# Altium project AD9434-500.PrjPcb
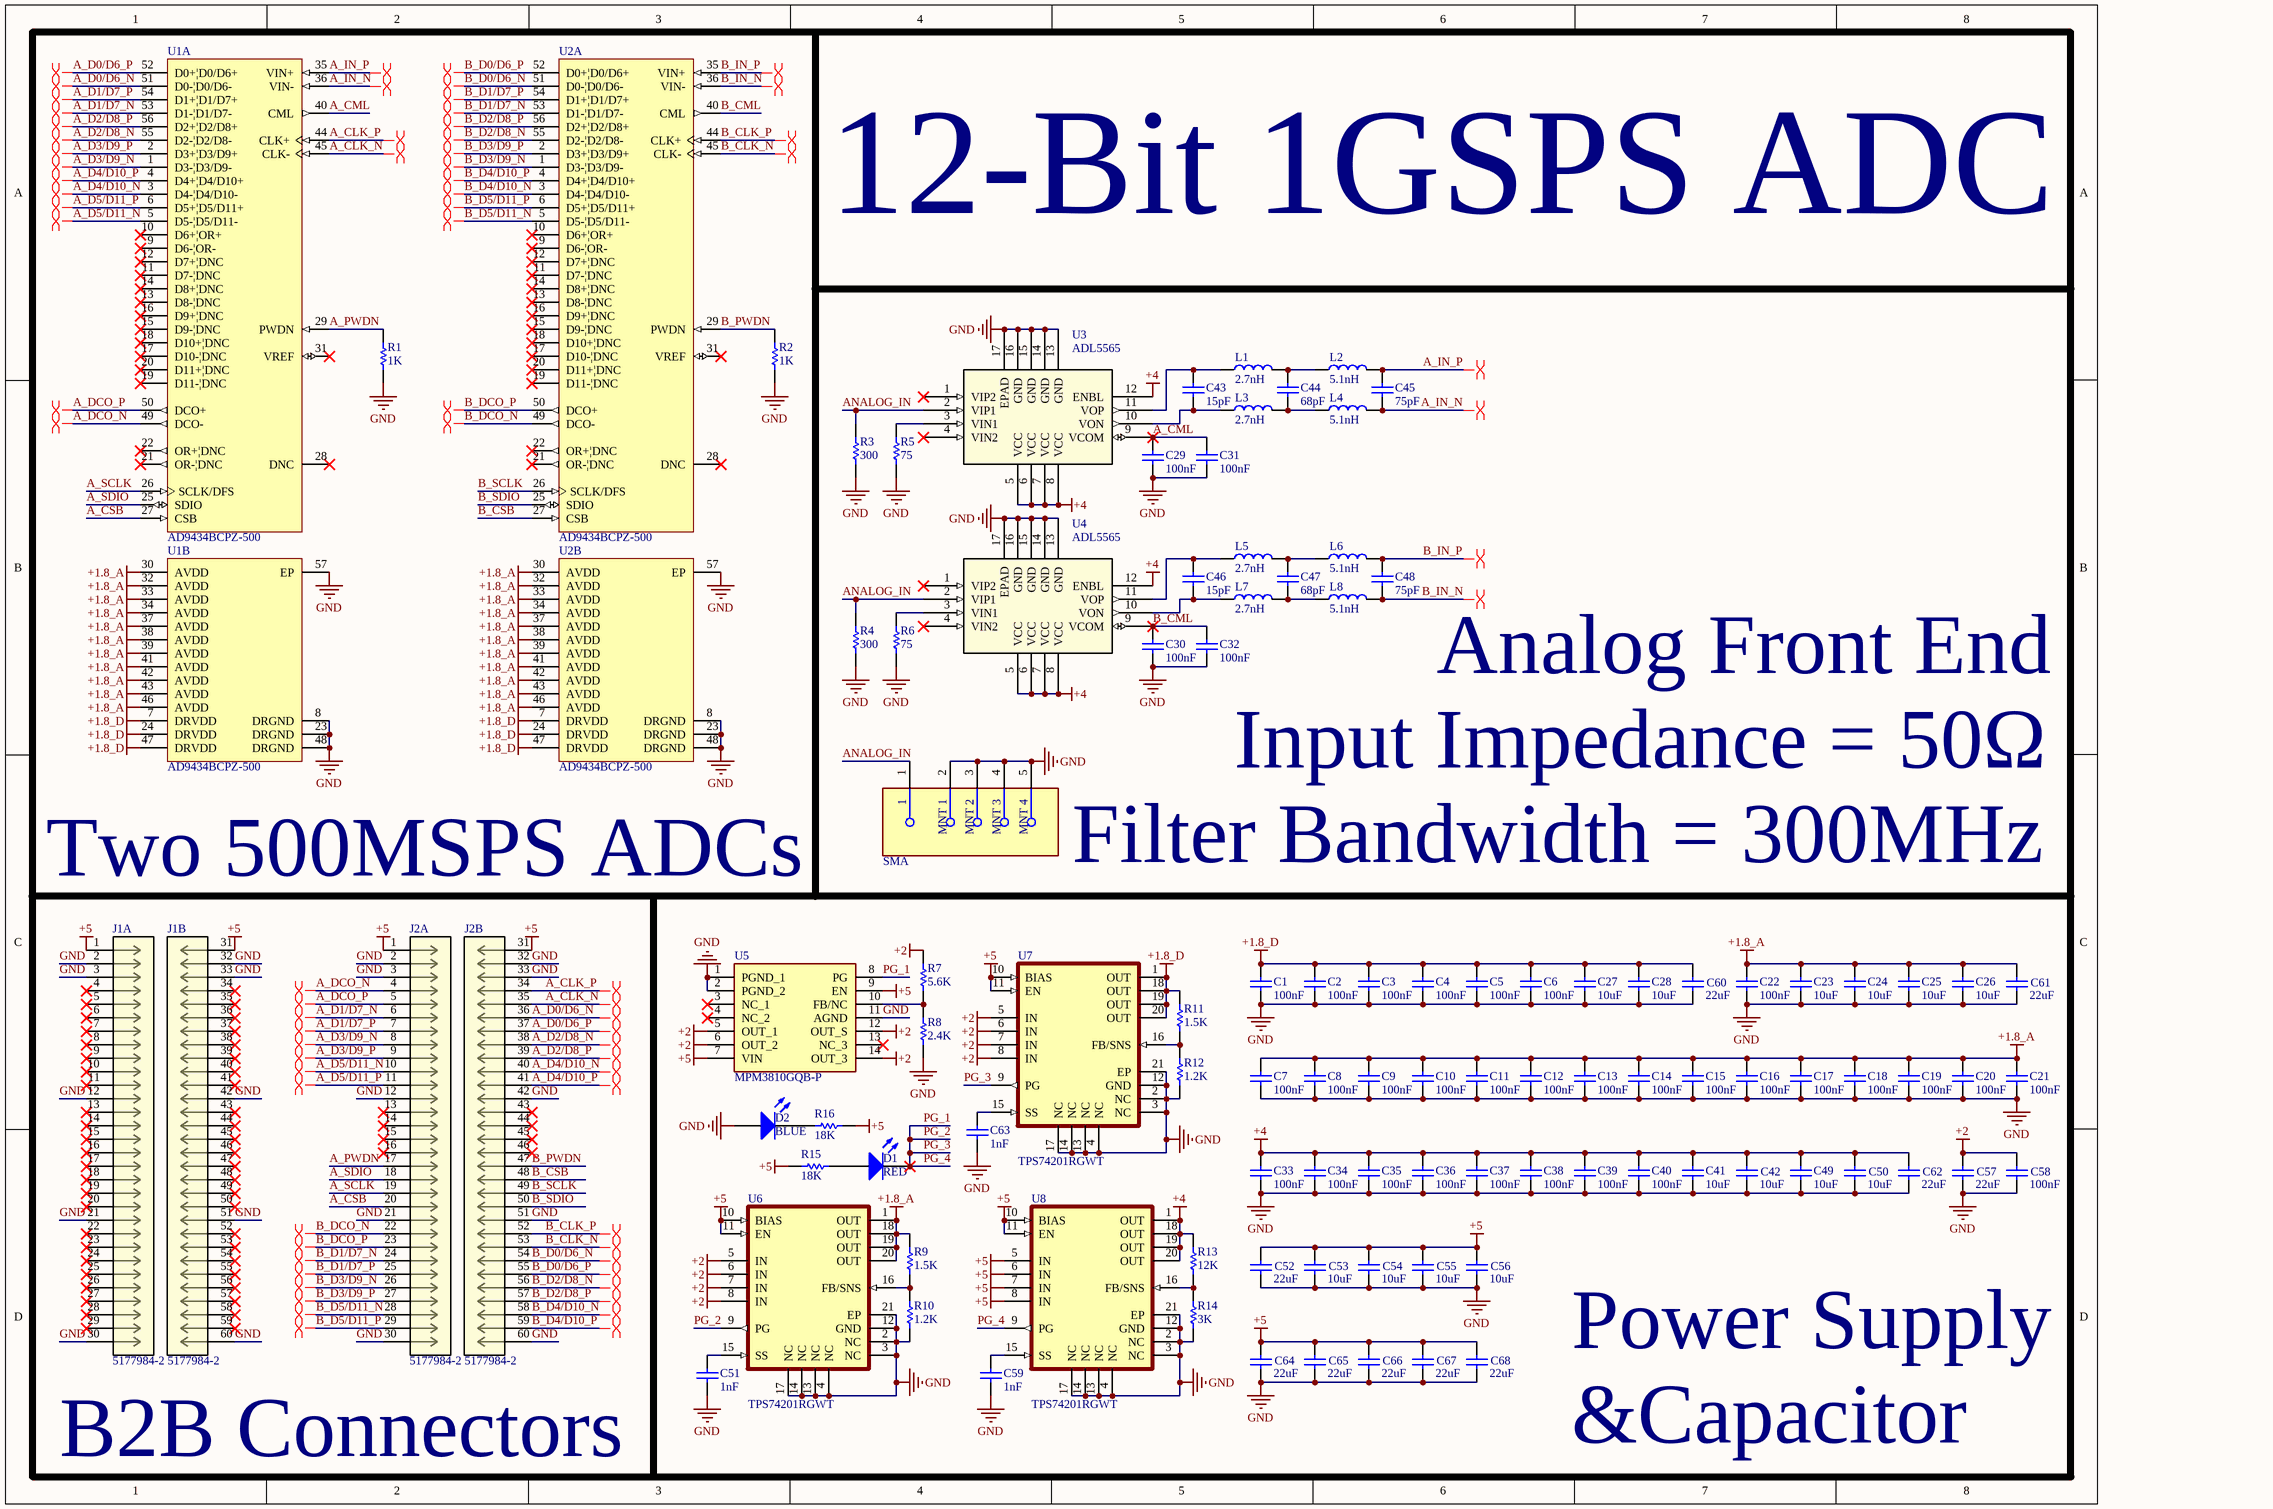
[diagram p0: AD9434-500.SchDoc]
1 sheet, 105 parts. Net scope: global (net labels, ports and power ports of the same name join across sheets).
Board file: AD9434-500.PcbDoc

## Sheet AD9434-500.SchDoc
size A3; SheetNumber: 1; SheetTotal: 1

### Parts
C1  100nF  [0402]
C2  100nF  [0402]
C3  100nF  [0402]
C4  100nF  [0402]
C5  100nF  [0402]
C6  100nF  [0402]
C7  100nF  [0402]
C8  100nF  [0402]
C9  100nF  [0402]
C10  100nF  [0402]
C11  100nF  [0402]
C12  100nF  [0402]
C13  100nF  [0402]
C14  100nF  [0402]
C15  100nF  [0402]
C16  100nF  [0402]
C17  100nF  [0402]
C18  100nF  [0402]
C19  100nF  [0402]
C20  100nF  [0402]
C21  100nF  [0402]
C22  100nF  [0402]
C23  10uF  [0402]
C24  10uF  [0402]
C25  10uF  [0402]
C26  10uF  [0402]
C27  10uF  [0402]
C28  10uF  [0402]
C29  100nF  [0402]
C30  100nF  [0402]
C31  100nF  [0402]
C32  100nF  [0402]
C33  100nF  [0402]
C34  100nF  [0402]
C35  100nF  [0402]
C36  100nF  [0402]
C37  100nF  [0402]
C38  100nF  [0402]
C39  100nF  [0402]
C40  100nF  [0402]
C41  10uF  [0402]
C42  10uF  [0402]
C43  15pF  [0402]
C44  68pF  [0402]
C45  75pF  [0402]
C46  15pF  [0402]
C47  68pF  [0402]
C48  75pF  [0402]
C49  10uF  [0402]
C50  10uF  [0402]
C51  1nF  [0402]
C52  22uF  [6-0805_L]
C53  10uF  [0402]
C54  10uF  [0402]
C55  10uF  [0402]
C56  10uF  [0402]
C57  22uF  [6-0805_L]
C58  100nF  [0402]
C59  1nF  [0402]
C60  22uF  [6-0805_L]
C61  22uF  [6-0805_L]
C62  22uF  [6-0805_L]
C63  1nF  [0402]
C64  22uF  [6-0805_L]
C65  22uF  [6-0805_L]
C66  22uF  [6-0805_L]
C67  22uF  [6-0805_L]
C68  22uF  [6-0805_L]
D1  RED  [1608[0603]]
D2  BLUE  [1608[0603]]
J1  5177984-2  [CONN_5177984-2_TYC]  (parts A,B of 2)
J2  5177984-2  [CONN_5177984-2_TYC]  (parts A,B of 2)
L1  2.7nH  [0402]
L2  5.1nH  [0402]
L3  2.7nH  [0402]
L4  5.1nH  [0402]
L5  2.7nH  [0402]
L6  5.1nH  [0402]
L7  2.7nH  [0402]
L8  5.1nH  [0402]
R1  1K  [0402]
R2  1K  [0402]
R3  300  [0402]
R4  300  [0402]
R5  75  [0402]
R6  75  [0402]
R7  5.6K  [0402]
R8  2.4K  [0402]
R9  1.5K  [0402]
R10  1.2K  [0402]
R11  1.5K  [0402]
R12  1.2K  [0402]
R13  12K  [0402]
R14  3K  [0402]
R15  18K  [0402]
R16  18K  [0402]
SMA  1053354-1  [FP-1053354-1-MFG]  (value not drawn)
U1  AD9434BCPZ-500  [CP-56-5_L]  (parts A,B of 2)
U2  AD9434BCPZ-500  [CP-56-5_L]  (parts A,B of 2)
U3  ADL5565  [CP_16_2_ADI-L]
U4  ADL5565  [CP_16_2_ADI-L]
U5  MPM3810GQB-P  [MPM3810GQB33Z]
U6  TPS74201RGWT  [QFN65P500X500X100-21N]
U7  TPS74201RGWT  [QFN65P500X500X100-21N]
U8  TPS74201RGWT  [QFN65P500X500X100-21N]

### Nets
+1.8_A: C7.1 C8.1 C9.1 C10.1 C11.1 C12.1 C13.1 C14.1 C15.1 C16.1 C17.1 C18.1 C19.1 C20.1 C21.1 C22.1 C23.1 C24.1 C25.1 C26.1 C61.1 R9.1 U1.30(AVDD) U1.32(AVDD) U1.33(AVDD) U1.34(AVDD) U1.37(AVDD) U1.38(AVDD) U1.39(AVDD) U1.41(AVDD) U1.42(AVDD) U1.43(AVDD) U1.46(AVDD) U2.30(AVDD) U2.32(AVDD) U2.33(AVDD) U2.34(AVDD) U2.37(AVDD) U2.38(AVDD) U2.39(AVDD) U2.41(AVDD) U2.42(AVDD) U2.43(AVDD) U2.46(AVDD) U6.1(OUT) U6.18(OUT) U6.19(OUT) U6.20(OUT)
+1.8_D: C1.1 C2.1 C3.1 C4.1 C5.1 C6.1 C27.1 C28.1 C60.1 R11.1 U1.7(DRVDD) U1.24(DRVDD) U1.47(DRVDD) U2.7(DRVDD) U2.24(DRVDD) U2.47(DRVDD) U7.1(OUT) U7.18(OUT) U7.19(OUT) U7.20(OUT)
+2: C57.1 C58.1 R7.1 U5.5(OUT_1) U5.6(OUT_2) U5.12(OUT_S) U5.14(OUT_3) U6.5(IN) U6.6(IN) U6.7(IN) U6.8(IN) U7.5(IN) U7.6(IN) U7.7(IN) U7.8(IN)
+4: C33.1 C34.1 C35.1 C36.1 C37.1 C38.1 C39.1 C40.1 C41.1 C42.1 C49.1 C50.1 C62.1 R13.1 U3.5(VCC) U3.6(VCC) U3.7(VCC) U3.8(VCC) U3.12(ENBL) U4.5(VCC) U4.6(VCC) U4.7(VCC) U4.8(VCC) U4.12(ENBL) U8.1(OUT) U8.18(OUT) U8.19(OUT) U8.20(OUT)
+5: C52.1 C53.1 C54.1 C55.1 C56.1 C64.1 C65.1 C66.1 C67.1 C68.1 J1.1 J1.31 J2.1 J2.31 R15.1 R16.2 U5.7(VIN) U5.9(EN) U6.10(BIAS) U6.11(EN) U7.10(BIAS) U7.11(EN) U8.5(IN) U8.6(IN) U8.7(IN) U8.8(IN) U8.10(BIAS) U8.11(EN)
GND: C1.2 C2.2 C3.2 C4.2 C5.2 C6.2 C7.2 C8.2 C9.2 C10.2 C11.2 C12.2 C13.2 C14.2 C15.2 C16.2 C17.2 C18.2 C19.2 C20.2 C21.2 C22.2 C23.2 C24.2 C25.2 C26.2 C27.2 C28.2 C29.2 C30.2 C31.2 C32.2 C33.2 C34.2 C35.2 C36.2 C37.2 C38.2 C39.2 C40.2 C41.2 C42.2 C49.2 C50.2 C51.2 C52.2 C53.2 C54.2 C55.2 C56.2 C57.2 C58.2 C59.2 C60.2 C61.2 C62.2 C63.2 C64.2 C65.2 C66.2 C67.2 C68.2 D2.1(A) J1.2 J1.3 J1.12 J1.21 J1.30 J1.32 J1.33 J1.42 J1.51 J1.60 J2.2 J2.3 J2.12 J2.21 J2.30 J2.32 J2.33 J2.42 J2.51 J2.60 R1.1 R2.1 R3.2 R4.2 R5.2 R6.1 R8.2 R10.2 R12.2 R14.2 SMA.2(MNT_1) SMA.3(MNT_2) SMA.4(MNT_3) SMA.5(MNT_4) U1.8(DRGND) U1.23(DRGND) U1.48(DRGND) U1.57(EP) U2.8(DRGND) U2.23(DRGND) U2.48(DRGND) U2.57(EP) U3.13(GND) U3.14(GND) U3.15(GND) U3.16(GND) U3.17(EPAD) U4.13(GND) U4.14(GND) U4.15(GND) U4.16(GND) U4.17(EPAD) U5.1(PGND_1) U5.2(PGND_2) U5.11(AGND) U6.2(NC) U6.3(NC) U6.4(NC) U6.12(GND) U6.13(NC) U6.14(NC) U6.17(NC) U6.21(EP) U7.2(NC) U7.3(NC) U7.4(NC) U7.12(GND) U7.13(NC) U7.14(NC) U7.17(NC) U7.21(EP) U8.2(NC) U8.3(NC) U8.4(NC) U8.12(GND) U8.13(NC) U8.14(NC) U8.17(NC) U8.21(EP)
A_CLK_N: J2.35 U1.45(CLK-)
A_CLK_P: J2.34 U1.44(CLK+)
A_CML: C29.1 C31.1 U1.40(CML) U3.9(VCOM)
A_CSB: J2.20 U1.27(CSB)
A_D0/D6_N: J2.36 U1.51(D0-|D0/D6-)
A_D0/D6_P: J2.37 U1.52(D0+|D0/D6+)
A_D1/D7_N: J2.6 U1.53(D1-|D1/D7-)
A_D1/D7_P: J2.7 U1.54(D1+|D1/D7+)
A_D2/D8_N: J2.38 U1.55(D2-|D2/D8-)
A_D2/D8_P: J2.39 U1.56(D2+|D2/D8+)
A_D3/D9_N: J2.8 U1.1(D3-|D3/D9-)
A_D3/D9_P: J2.9 U1.2(D3+|D3/D9+)
A_D4/D10_N: J2.40 U1.3(D4-|D4/D10-)
A_D4/D10_P: J2.41 U1.4(D4+|D4/D10+)
A_D5/D11_N: J2.10 U1.5(D5-|D5/D11-)
A_D5/D11_P: J2.11 U1.6(D5+|D5/D11+)
A_DCO_N: J2.4 U1.49(DCO-)
A_DCO_P: J2.5 U1.50(DCO+)
A_IN_N: C45.2 L4.2 U1.36(VIN-)
A_IN_P: C45.1 L2.2 U1.35(VIN+)
A_PWDN: J2.17 R1.2 U1.29(PWDN)
A_SCLK: J2.19 U1.26(SCLK/DFS)
A_SDIO: J2.18 U1.25(SDIO)
ANALOG_IN: R3.1 R4.1 SMA.1 U3.2(VIP1) U4.2(VIP1)
B_CLK_N: J2.53 U2.45(CLK-)
B_CLK_P: J2.52 U2.44(CLK+)
B_CML: C30.1 C32.1 U2.40(CML) U4.9(VCOM)
B_CSB: J2.48 U2.27(CSB)
B_D0/D6_N: J2.54 U2.51(D0-|D0/D6-)
B_D0/D6_P: J2.55 U2.52(D0+|D0/D6+)
B_D1/D7_N: J2.24 U2.53(D1-|D1/D7-)
B_D1/D7_P: J2.25 U2.54(D1+|D1/D7+)
B_D2/D8_N: J2.56 U2.55(D2-|D2/D8-)
B_D2/D8_P: J2.57 U2.56(D2+|D2/D8+)
B_D3/D9_N: J2.26 U2.1(D3-|D3/D9-)
B_D3/D9_P: J2.27 U2.2(D3+|D3/D9+)
B_D4/D10_N: J2.58 U2.3(D4-|D4/D10-)
B_D4/D10_P: J2.59 U2.4(D4+|D4/D10+)
B_D5/D11_N: J2.28 U2.5(D5-|D5/D11-)
B_D5/D11_P: J2.29 U2.6(D5+|D5/D11+)
B_DCO_N: J2.22 U2.49(DCO-)
B_DCO_P: J2.23 U2.50(DCO+)
B_IN_N: C48.2 L8.2 U2.36(VIN-)
B_IN_P: C48.1 L6.2 U2.35(VIN+)
B_PWDN: J2.47 R2.2 U2.29(PWDN)
B_SCLK: J2.49 U2.26(SCLK/DFS)
B_SDIO: J2.50 U2.25(SDIO)
PG_1: D1.2(K) U5.8(PG) U6.9(PG) U7.9(PG) U8.9(PG)  [also labelled PG_2, PG_3, PG_4]
NetC43_1: C43.1 L1.1 U3.11(VOP)
NetC43_2: C43.2 L3.1 U3.10(VON)
NetC44_1: C44.1 L1.2 L2.1
NetC44_2: C44.2 L3.2 L4.1
NetC46_1: C46.1 L5.1 U4.11(VOP)
NetC46_2: C46.2 L7.1 U4.10(VON)
NetC47_1: C47.1 L5.2 L6.1
NetC47_2: C47.2 L7.2 L8.1
NetC51_1: C51.1 U6.15(SS)
NetC59_1: C59.1 U8.15(SS)
NetC63_1: C63.1 U7.15(SS)
NetD1_1: D1.1(A) R15.2
NetD2_2: D2.2(K) R16.1
NetR5_1: R5.1 U3.3(VIN1)
NetR6_2: R6.2 U4.3(VIN1)
NetR7_2: R7.2 R8.1 U5.10(FB/NC)
NetR9_2: R9.2 R10.1 U6.16(FB/SNS)
NetR11_2: R11.2 R12.1 U7.16(FB/SNS)
NetR13_2: R13.2 R14.1 U8.16(FB/SNS)

Not connected (* = marked no-connect by the designer): J1 4* 5* 6* 7* 8* 9* 10* 11* 13* 14* 15* 16* 17* 18* 19* 20* 22* 23* 24* 25* 26* 27* 28* 29* 34* 35* 36* 37* 38* 39* 40* 41* 43* 44* 45* 46* 47* 48* 49* 50* 52* 53* 54* 55* 56* 57* 58* 59*; J2 13* 14* 15* 16* 43* 44* 45* 46*; U1 9(D6-|OR-)* 10(D6+|OR+)* 11(D7-|DNC)* 12(D7+|DNC)* 13(D8-|DNC)* 14(D8+|DNC)* 15(D9-|DNC)* 16(D9+|DNC)* 17(D10-|DNC)* 18(D10+|DNC)* 19(D11-|DNC)* 20(D11+|DNC)* 21(OR-|DNC)* 22(OR+|DNC)* 28(DNC)* 31(VREF)*; U2 9(D6-|OR-)* 10(D6+|OR+)* 11(D7-|DNC)* 12(D7+|DNC)* 13(D8-|DNC)* 14(D8+|DNC)* 15(D9-|DNC)* 16(D9+|DNC)* 17(D10-|DNC)* 18(D10+|DNC)* 19(D11-|DNC)* 20(D11+|DNC)* 21(OR-|DNC)* 22(OR+|DNC)* 28(DNC)* 31(VREF)*; U3 1(VIP2)* 4(VIN2)*; U4 1(VIP2)* 4(VIN2)*; U5 3(NC_1)* 4(NC_2)* 13(NC_3)*

### Layout directives
differential pair: A_CLK_N, A_CLK_P, A_D0/D6_N, A_D0/D6_P, A_D1/D7_N, A_D1/D7_P, A_D2/D8_N, A_D2/D8_P, A_D3/D9_N, A_D3/D9_P, A_D4/D10_N, A_D4/D10_P, A_D5/D11_N, A_D5/D11_P, A_DCO_N, A_DCO_P, A_IN_N, A_IN_P, B_CLK_N, B_CLK_P, B_D0/D6_N, B_D0/D6_P, B_D1/D7_N, B_D1/D7_P, B_D2/D8_N, B_D2/D8_P, B_D3/D9_N, B_D3/D9_P, B_D4/D10_N, B_D4/D10_P, B_D5/D11_N, B_D5/D11_P, B_DCO_N, B_DCO_P, B_IN_N, B_IN_P

### Notes on the sheet
- 12-Bit 1GSPS ADC
- Analog Front End
- (near C32) Input Impedance = 50Ω
- Two 500MSPS ADCs
- (near SMA) Filter Bandwidth = 300MHz
- Power Supply
- &Capacitor
- (near J1) B2B Connectors
- Title:
- Size:
- Date:
- A4
- No.:
- Sheet           of
- Revision:
- Author:
- File:

### Library data of the parts
C1-C68 = CAP: Capacitor; Value: 104; Published: 8-Jun-2000; LatestRevisionDate: 17-Jul-2002; LatestRevisionNote: Re-released for DXP Platform.; PackageReference: RAD-0.3; Publisher: Altium Limited
D1 D2 = LED0: Typical INFRARED GaAs LED; Published: 8-Jun-2000; LatestRevisionDate: 08-Jul-2005; LatestRevisionNote: Mech Layer 1 removed.; PackageReference: LED-0; Publisher: Altium Limited; PackageDescription: LED; 2 Leads
J1 J2 = 5177984-2: No Description Available; Mfr_Name: TE Connectivity; Copyright: Copyright (C) 2022 Ultra Librarian. All rights reserved.; Manufacturer_Part_Number: 5177984-2; RefDes: RefDes; Type: DEV
L1-L8 = FB: 磁珠
R1 R2 = RES: Resistor; Published: 8-Jun-2000; Revision: July-2002: Re-released for DXP Platform.; Publisher: Altium Limited; Value: 1K
R3-R16 = RES: Resistor; Value: 1K; Published: 8-Jun-2000; Revision: July-2002: Re-released for DXP Platform.; Publisher: Altium Limited
SMA = CMP-2000-05830-2: CONN SMA JACK STR 50 OHM PCB; Dielectric Material: PTFE; Impedance: 50R; Frequency: 18GHz; Polarity: Normal; Body Material: Stainless Steel; Max Frequency: 12.4GHz; Center Contact Plating: Gold; PCB Mounting Orientation: Vertical; Mating Cycles: 500; Gender: Female; Number of Ports: 1; Packaging: Bag; Contact Plating: Gold; REACH SVHC: No SVHC; Radiation Hardening: No; Mount: Through Hole; Fastening Type: Threaded; Package Quantity: 125; Connector Type: SMA; Operating Frequency: N/A; Height: 9.5mm; Plating: Gold; RoHS Compliant: Yes; Insulation Material: Polytetrafluoroethylene; Length: 9.53mm; Contact Material: Copper; Orientation: Straight; Case/Package: SMA; Depth: 6.3mm; Series: SMA; Termination: Solder; Housing Color: Gold; Body Plating: Gold
U1 U2 = CMP-0313-02358-2: Single 12-Bit Analog-to-Digital Converter with Parallel Interface, 1.8 V, 500MSPS, -40 to +85 degC, CP-56-5, Pb-Free, Tray; Generic Part Number: AD9434-500; Manufacturer: Analog Devices; Throughput Rate (SPS): 500M; Resolution (Bits): 12; Interface: Par; Channels: 1; PackageDescription: 56-Lead Lead Frame Chip Scale Package [LFCSP_VQ] 8 x 8 mm Body, Very Thin Quad; PartNumber: AD9434BCPZ-500; Packing: Tray; PackageReference: CP-56-5; Mounting Technology: Surface Mount; ComponentLink1URL: http://www.analog.com/en/index.html; ComponentLink3Description: Package Specification; ComponentLink4URL: http://www.analog.com/en/analog-to-digital-converters/ad-converters/ad9434/products/product.html; ComponentLink2Description: Datasheet; RoHS: Y; ComponentLink3URL: http://www.analog.com/static/imported-files/packages/PKG_PDF/LFCSP(CP)/CP-56/CP_56_5.pdf; ComponentLink2URL: http://www.analog.com/static/imported-files/data_sheets/AD9434.pdf; ComponentLink4Description: Product URL; Code_JEDEC: MO-220-WLLD-2; ComponentLink1Description: Manufacturer URL; PackageVersion: 072709-A; DatasheetVersion: Rev.A
U3 U4 = ADL5565: No Description Available; Mfr_Name: Analog Devices Inc; Copyright: Copyright (C) 2022 Ultra Librarian. All rights reserved.; Manufacturer_Part_Number: ADL5565; RefDes: RefDes; Type: DEV
U5 = MPM3810GQB-P: Integrated Circuit; Manufacturer_Name: Monolithic Power Systems (MPS); Datasheet Link: https://www.monolithicpower.com/pub/media/document/MPM3810_r1.1.pdf; Height: 1mm; Manufacturer_Part_Number: MPM3810GQB-P; Mouser Part Number: 946-MPM3810GQBP; Mouser Price/Stock: https://www.mouser.co.uk/ProductDetail/Monolithic-Power-Systems-MPS/MPM3810GQB-P?qs=QEkzKklKf2S%252BUubfiGImEA%3D%3D
U6-U8 = TPS74201RGWT: Package: None; Price: None; Value: *; MP: TPS74201RGWT; Availability: Unavailable